# EAGLE schematic MPU-9250_board_plug (EAGLE 9.4.2)
DESIGNER: Brent Wilkins; VERSION: v10
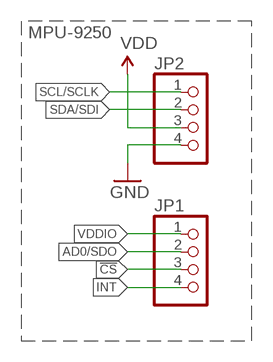
[diagram p0: schematic, sheet 1]

## Parts
JP1  PINHD-1X04_2.54-S  [1X04-S]
JP2  PINHD-1X04_2.54-S  [1X04-S]

## Nets
!CS: JP1.3
AD0/SDO: JP1.2
GND: JP2.4
INT: JP1.4
SCL/SCLK: JP2.1
SDA/SDI: JP2.2
VDD: JP2.3
VDDIO: JP1.1

## Notes on the sheet
- MPU-9250

## Library data of the parts
JP1 JP2 = pinhead-2:PINHD-1X04: PIN HEADER